# Altium schematic sheet 3V3 LDO Regulator (NonSleeping).SchDoc: 3V3 LDO Voltage Regulator (NonSleeping)
size A4; SheetNumber: 14; SheetTotal: 37
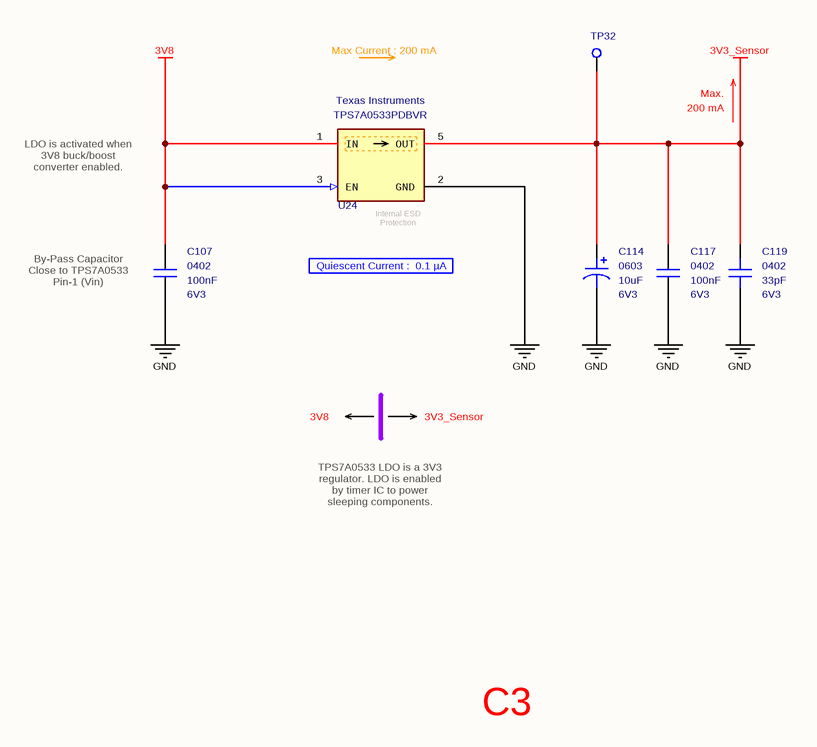
[diagram p0: 3V3 LDO Regulator (NonSleeping).SchDoc]

## Parts
C107  value 100nF  Case: 0402  Voltage: 6V3  [CAPACITOR_0402]  (hidden comment: Multilayer Ceramic Capacitor)
C114  value 10uF  Case: 0603  Voltage: 6V3  [CAPACITOR_0603 - TANTALUM]  (hidden comment: Tantalum Capacitor)
C117  value 100nF  Case: 0402  Voltage: 6V3  [CAPACITOR_0402]  (hidden comment: Multilayer Ceramic Capacitor)
C119  value 33pF  Case: 0402  Voltage: 6V3  [CAPACITOR_0402]  (hidden comment: Multilayer Ceramic Capacitor)
TP32  PCB - Test Point  [Test_Pad - Hole]  (value not drawn)  (no BOM)
U24  Manufacturer_Part_Number: TPS7A0533PDBVR  Manufacturer_Name: Texas Instruments  [SOT-23-5]  (hidden comment: LDO Voltage Regulator)

## Nets
3V3_Sensor: C114.1 C117.2 C119.1 TP32.1 U24.5(OUT)
3V8: C107.1 U24.1(IN) U24.3(EN)
GND: C107.2 C114.2 C117.1 C119.2 U24.2(GND)

## Notes on the sheet
- Max Current : 200 mA
- Max.
- 200 mA
- LDO is activated when 3V8 buck/boost converter enabled.
- (near U24) Internal ESD Protection
- (near C107) By-Pass Capacitor
  Close to TPS7A0533
  Pin-1 (Vin)
- Quiescent Current :  0.1 µA
- 3V8
- 3V3_Sensor
- TPS7A0533 LDO is a 3V3 regulator. LDO is enabled by timer IC to power sleeping components.
- C3
- Title
- Size:
- Date:
- A4
- Number:
- Time:
- Revision:
- Sheet
- of
- File:

## Library data of the parts
C107 C117 = Capacitor - 100nF [0402-6V3]: Capacitor - 100nF [0402-6V3] (Ceramic); Manufacturer_Name: AVX; Manufacturer_Part_Number: 04026D104KAT4A; Dielectric: X5R; Tolerance: %10; Height: 0.25mm; Mouser_Part_Number: 581-04026D104KAT4A; ComponentLink1Description: Mouser; ComponentLink1URL: https://www.mouser.com.tr/ProductDetail/AVX/04026D104KAT4A?qs=sGAEpiMZZMs0AnBnWHyRQPg4iYkCw7IMED%2F4kpqgf7w%3D; ComponentLink2Description: DataSheet; ComponentLink2URL: https://www.mouser.com.tr/datasheet/2/40/cx5r-776519.pdf; ROHS: Yes; Maximum Operating Temperature: +85; Minimum Operating Temperature: -55; Supplier 1: Avnet; Supplier Part Number 1: 04026D104KAT4A
C114 = Capacitor - 10uF [0603-6V3] (Tantalium): Capacitor - 10uF [0603] (Tantalium); Manufacturer_Name: AVX; Manufacturer_Part_Number: F380J106MMAAH3; ESR: 200 mOhms; Leakage Current: 10uA; Tolerance: 20%; Height: 0.8mm; Mouser_Part_Number: 581-F380J106MMAAH3; Maximum Operating Temperature: +105; Minimum Operating Temperature: -55; ROHS: Yes; ComponentLink1Description: DataSheet; ComponentLink1URL: https://www.mouser.com.tr/datasheet/2/40/f38-775706.pdf; ComponentLink2Description: Mouser; ComponentLink2URL: https://www.mouser.com.tr/ProductDetail/AVX/F380J106MMAAH3?qs=sGAEpiMZZMtZ1n0r9vR22fixilZl6Mr8zRKleESmvcDFwZ4LSyC6Pg%3D%3D; Supplier 1: Mouser; Supplier 2: Digi-Key; Supplier Part Number 2: 478-12031-1-ND; Supplier Part Number 1: 581-F380J106MMAAH3
C119 = Capacitor - 33pF [0402-6V3]: Capacitor - 33pF [0402] (Ceramic); Manufacturer_Name: Kemet; Manufacturer_Part_Number: C0402C330J9RACAUTO; Dielectric: X7R; Tolerance: 10%; Height: 0.5mm; Mouser_Part_Number: 80-C0402C330J9RAUTO; Maximum Operating Temperature: +125; Minimum Operating Temperature: -55; ROHS: Yes; ComponentLink1Description: DataSheet; ComponentLink1URL: https://api.kemet.com/component-edge/download/datasheet/C0402C330J9RACAUTO.pdf; ComponentLink2Description: Mouser; ComponentLink2URL: https://www.mouser.com/Search/Refine.aspx?Keyword=80-C0402C330J9RAUTO; Supplier 1: Mouser; Supplier Part Number 1: 80-C0402C330J9RAUTO
TP32 = PCB - Test Point: Test Point
U24 = IC - TPS7A0533PDBVR: LDO Voltage Regulators Cap-Free NMOS 200mA; Output Voltage: 3V3; Dropout Voltage - Max: 235 mV at 200 mA; Mouser_Part_Number: 595-TPS7A0533PDBVR; ComponentLink1Description: DataSheet; ComponentLink1URL: http://www.ti.com/general/docs/suppproductinfo.tsp?distId=26&gotoUrl=http%3A%2F%2Fwww.ti.com%2Flit%2Fgpn%2Ftps731; ComponentLink2Description: Mouser; ComponentLink2URL: https://eu.mouser.com/ProductDetail/Texas-Instruments/TPS73150DBVR?qs=6zVL%252ByCp0mpoSoYHNmngNA%3D%3D; Minimum Operating Temperature: -40; Output Current: 200 mA; Maximum Operating Temperature: +125; Supplier 1: Mouser; Supplier 2: Digi-Key; Case: SOT-23-5; Supplier Part Number 1: 595-TPS7A0533PDBVR; Supplier Part Number 2: 296-TPS7A0533PDBVRCT-ND